# EAGLE design v1 (EAGLE 9.5.2)
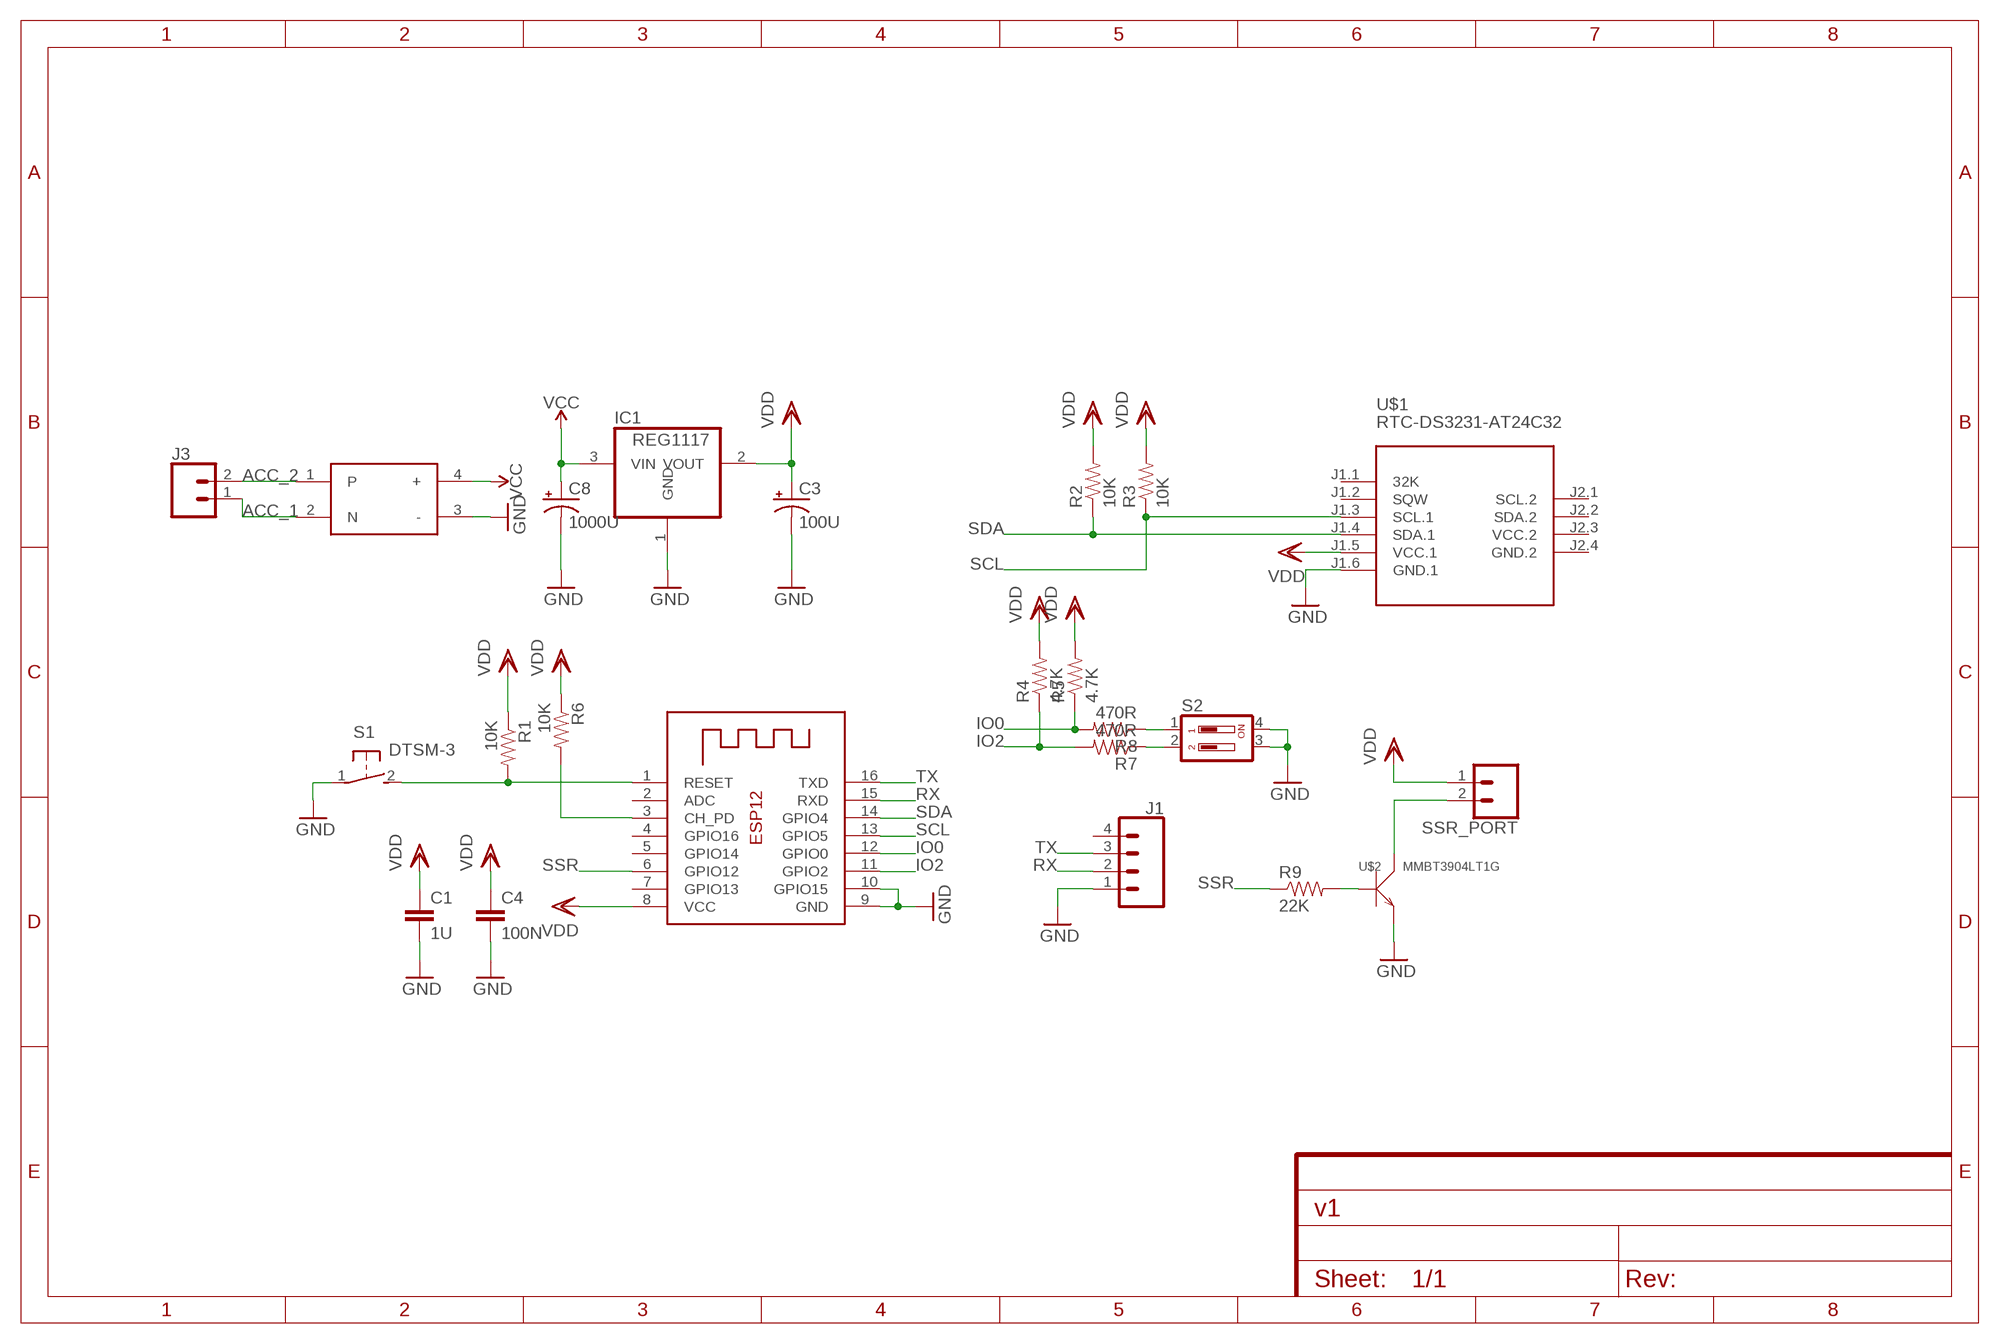
[diagram p0: schematic, sheet 1]

## Parts
C1  1U  CAP1206  [1206]
C3  100U  CAP_POLPTH1  [CPOL-RADIAL-100UF-25V]
C4  100N  CAP1206  [1206]
C8  1000U  1000UF-RADIAL-5MM-25V-20%  [CPOL-RADIAL-5MM-10MM]
IC1  REG1117  [SOT223]
J1  CONN_04  [1X04]
J3  CONN_023.5MM  [SCREWTERMINAL-3.5MM-2]
R1  10K  RESISTOR1206  [1206]
R2  10K  RESISTOR1206  [1206]
R3  10K  RESISTOR1206  [1206]
R4  4.7K  RESISTOR1206  [1206]
R5  4.7K  RESISTOR1206  [1206]
R6  10K  RESISTOR1206  [1206]
R7  470R  RESISTOR1206  [1206]
R8  470R  RESISTOR1206  [1206]
R9  22K  RESISTOR1206  [1206]
S1  DTSM-3  [DTSM-3]
S2  DP02  [DP-02]
SSR_PORT  CONN_023.5MM  [SCREWTERMINAL-3.5MM-2]
U$1  RTC-DS3231-AT24C32  [RTC-DS3231-AT24C32]
U$2  MMBT3904LT1G  SMD-TRANSISTORS-NPN-40V-200MA-MMBT3904LT1G(SOT-23)  [SOT-23]
U$3  AC_DC  [AC_DC]
X1  ESP-12  [ESP-12]

## Nets
ACC_1: J3.1 U$3.2(N)
ACC_2: J3.2 U$3.1(P)
GND: C1.2 C3.2(-) C4.2 C8.- IC1.1(GND) J1.1 S1.1 S2.3 S2.4 U$1.J1.6(GND.1) U$2.2(E) U$3.3(-) X1.9(GND) X1.10(GPIO15)
IO0: R5.1 R8.2 X1.12(GPIO0)
IO2: R4.1 R7.2 X1.11(GPIO2)
N$1: R1.2 S1.2 X1.1(RESET)
N$2: R6.2 X1.3(CH_PD)
N$3: R7.1 S2.2
N$4: R8.1 S2.1
N$6: R9.2 U$2.1(B)
N$8: SSR_PORT.2 U$2.3(C)
RX: J1.2 X1.15(RXD)
SCL: R3.1 U$1.J1.3(SCL.1) X1.13(GPIO5)
SDA: R2.1 U$1.J1.4(SDA.1) X1.14(GPIO4)
SSR: R9.1 X1.6(GPIO12)
TX: J1.3 X1.16(TXD)
VCC: C8.+ IC1.3(VIN) U$3.4(+)
VDD: C1.1 C3.1(+) C4.1 IC1.2(VOUT) R1.1 R2.2 R3.2 R4.2 R5.2 R6.1 SSR_PORT.1 U$1.J1.5(VCC.1) X1.8(VCC)
Unconnected: J1.4 U$1.J1.1(32K) U$1.J1.2(SQW) U$1.J2.1(SCL.2) U$1.J2.2(SDA.2) X1.2(ADC) X1.4(GPIO16) X1.5(GPIO14) X1.7(GPIO13)

## Power pins joined to a net without a drawn wire
GND.2: U$1.J2.4(GND.2)
VCC.2: U$1.J2.3(VCC.2)

## Library data of the parts
C1 C4 = SparkFun-Capacitors:CAP: Generic SMD Capacitor
C3 = SparkFun-Passives:CAP_POL: Capacitor Polarized These are standard SMD and PTH capacitors. Normally 10uF, 47uF, and 100uF in electrolytic and tantalum varieties. Always verify the external diameter of the through hole cap, it varies with capacity, voltage, and manufacturer. The EIA devices should be standard.
C8 = SparkFun-Capacitors:1000UF: 1,000µF/1mF ceramic capacitors A capacitor is a passive two-terminal electrical component used to store electrical energy temporarily in an electric field. CAP-08070; PROD_ID: CAP-09538; VALUE: 1mF
IC1 = Ario-PowerIC:REG1117: 800mA and 1A Low Dropout (LDO) Positive Regulator 1.8V, 2.5V, 2.85V, 3.3V, 5V, and Adj; MPN: REG1117; OC_FARNELL: 1097566; OC_NEWARK: 14P6981
J1 = SparkFun-Connectors:CONN_04: Multi connection point. Often used as Generic Header-pin footprint for 0.1 inch spaced/style header connections On any of the 0.1 inch spaced packages, you can populate with these: Break Away Headers - Straight <https://www.sparkfun.com/products/116> (PRT-00116) Break Away Male Headers - Right Angle <https://www.sparkfun.com/products/553> (PRT-00553) Female Headers <https://www.sparkfun.com/products/115> (PRT-00115) Break Away Headers - Machine Pin <https://www.sparkfun.com/products/117> (PRT-00117) Break Away Female Headers - Swiss Machine Pin <https://www.sparkfun.com/products/743> (PRT-00743) For SCREWTERMINALS and SPRING TERMINALS visit here: Screw Terimnals on SparkFun.com <https://www.sparkfun.com/search/results?term=Screw+Terminals> (5mm/3.5mm/2.54mm spacing) This device is also useful as a general connection point to wire up your design to another part of your project. Our various solder wires solder well into these plated through hole pads. Hook-Up Wire - Assortment (Stranded, 22 AWG) <https://www.sparkfun.com/products/11375> (PRT-11375) Hook-Up Wire - Assortment (Solid Core, 22 AWG) <https://www.sparkfun.com/products/11367> (PRT-11367) View the entire wire category on our website here <https://www.sparkfun.com/categories/141> Special notes: Molex polarized connector foot print use with SKU : PRT-08231 with associated crimp pins and housings. 1MM SMD Version SKU: PRT-10208; PROD_ID: CONN-09696
J3 SSR_PORT = SparkFun-Connectors:CONN_02: Multi connection point. Often used as Generic Header-pin footprint for 0.1 inch spaced/style header connections On any of the 0.1 inch spaced packages, you can populate with these: Break Away Headers - Straight <https://www.sparkfun.com/products/116> (PRT-00116) Break Away Male Headers - Right Angle <https://www.sparkfun.com/products/553> (PRT-00553) Female Headers <https://www.sparkfun.com/products/115> (PRT-00115) Break Away Headers - Machine Pin <https://www.sparkfun.com/products/117> (PRT-00117) Break Away Female Headers - Swiss Machine Pin <https://www.sparkfun.com/products/743> (PRT-00743) For SCREWTERMINALS and SPRING TERMINALS visit here: Screw Terimnals on SparkFun.com <https://www.sparkfun.com/search/results?term=Screw+Terminals> (5mm/3.5mm/2.54mm spacing) This device is also useful as a general connection point to wire up your design to another part of your project. Our various solder wires solder well into these plated through hole pads. Hook-Up Wire - Assortment (Stranded, 22 AWG) <https://www.sparkfun.com/products/11375> (PRT-11375) Hook-Up Wire - Assortment (Solid Core, 22 AWG) <https://www.sparkfun.com/products/11367> (PRT-11367) View the entire wire category on our website here <https://www.sparkfun.com/categories/141> Special notes: Molex polarized connector foot print use with: PRT-08233 with associated crimp pins and housings. 2.54_SCREWTERM for use with PRT-10571. 3.5mm Screw Terminal footprints for PRT-08084 5mm Screw Terminal footprints for use with PRT-08432; PROD_ID: CONN-08399
R1-R9 = SparkFun-Passives:RESISTOR: Resistor Basic schematic elements and footprints for 0603, 1206, and PTH resistors.
S1 = switch-tact:DTSM-3
S2 = switch-dil:DP02: DIL/CODE SWITCH; MPN: MCDP02; OC_FARNELL: 1255233; OC_NEWARK: 26M1095
U$1 = diy-modules:RTC-DS3231-AT24C32: RTC Module with Battery and EEPROM based on DS3231 and AT24C32 chips Tutorial can be found here: https://edwardmallon.wordpress.com/2014/05/21/using-a-cheap-3-ds3231-rtc-at24c32-eeprom-from-ebay/ Click here to find device on ebay.com <http://www.ebay.com/sch/DS3231+AT24C32+module>
U$2 = Seeed-Transistor:SMD-TRANSISTORS-NPN-40V-200MA-MMBT3904LT1G(SOT-23): 305010013; MPN: MMBT3904LT1G
U$3 = Modules:AC_DC
X1 = adafruit:ESP-12

## Board
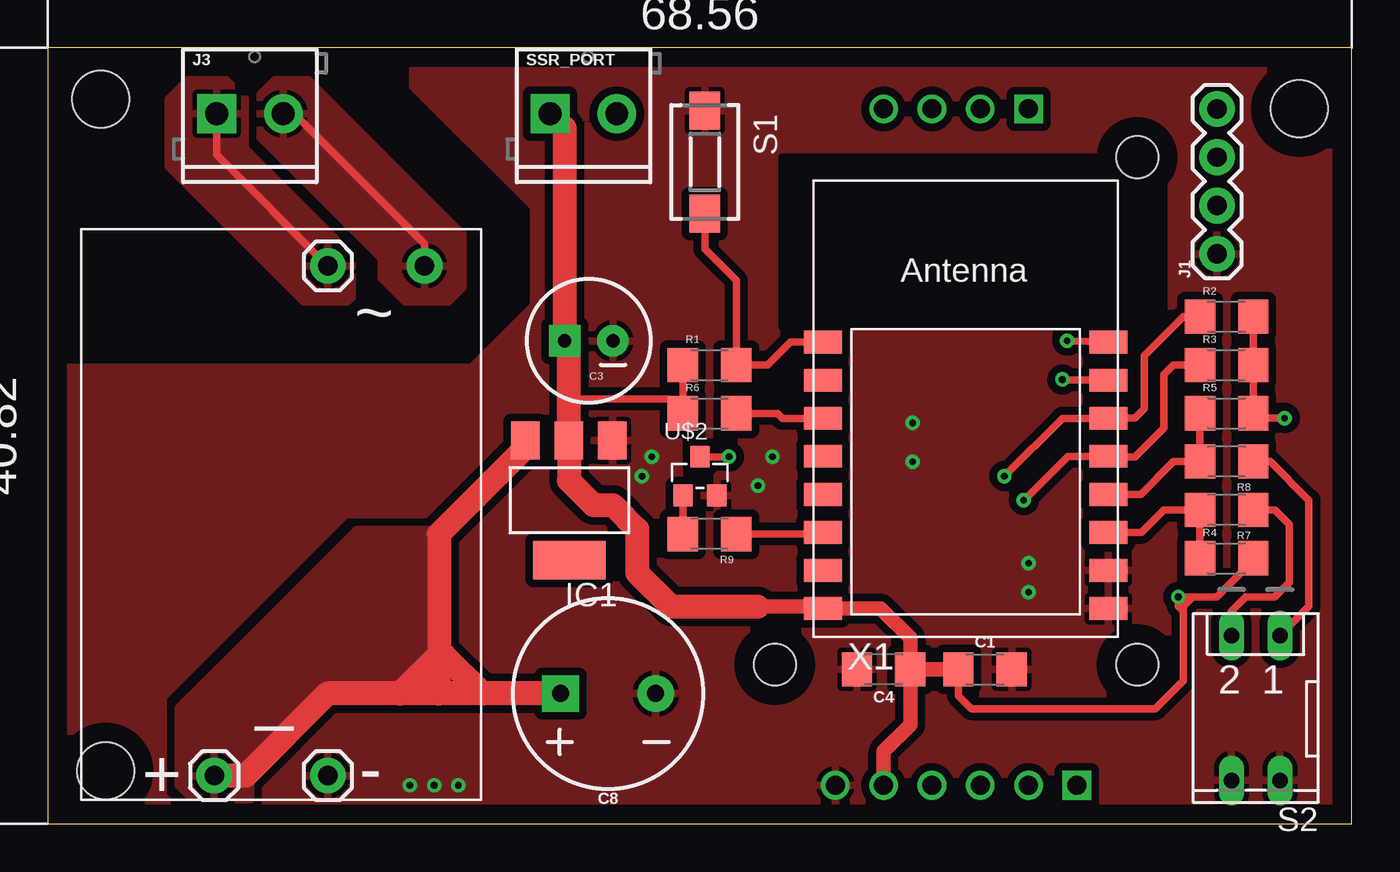
[diagram p1: board, top side]
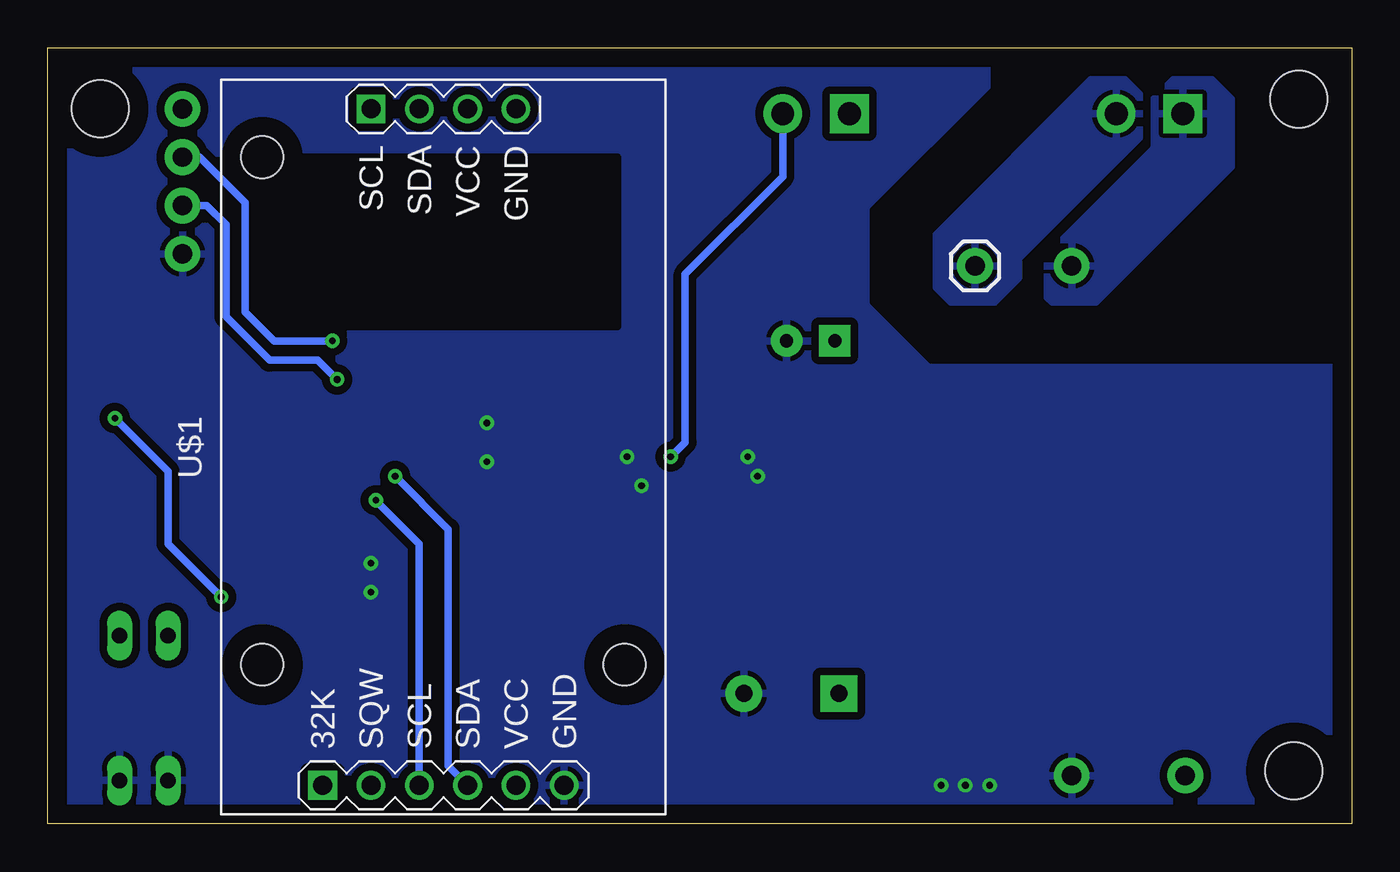
[diagram p2: board, bottom side, seen from below]

Size 68.56 x 40.82 mm. Coordinates in mm from the lower left corner, seen from the top.
Outline: 0,0 68.56,0 68.56,40.82 0,40.82 0,0
Copper layers (1*16): Top 0.035mm / dielectric 1.5mm / Bottom 0.035mm
Design rules "default *": minimum track width 6mil, minimum drill 0.35mm, track to track 16mil, track to pad 16mil, pad to pad 16mil, via to via 16mil, smd to smd 16mil, copper to edge 40mil, drill to drill 6mil, minimum pad ring 10mil, minimum via ring 8mil, stop-mask expansion 4mil, vias tented up to drill 0mil, thermal gap 10mil
Holes 3 mm at 65.79,37.59 3.05,2.79 2.79,38.1

### Footprints (pad centres in the part's own frame; a part is rotated, then mirrored left to right if it is on the bottom)
1206 = smd 1.6 x 1.8: 1 -1.4,0; 2 1.4,0
CPOL-RADIAL-100UF-25V = drill 0.7 pad 1.651 square: 1 1.27,0 | drill 0.7 pad 1.651: 2 -1.27,0
CPOL-RADIAL-5MM-10MM = drill 0.9 pad 1.93 square: + 2.5,0 | drill 0.9 pad 1.93: - -2.5,0
SOT223 = smd 1.499 x 2.007: 1 -2.261,-3.15; 2 0.025,-3.15; 3 2.311,-3.15 | smd 3.81 x 2.007: 4 0,3.15
1X04 = drill 1.016 pad 1.88: 1 0,0; 2 2.54,0; 3 5.08,0; 4 7.62,0
SCREWTERMINAL-3.5MM-2 = drill 1.2 pad 2.032 square: 1 0,0 | drill 1.2 pad 2.032: 2 3.5,0
DTSM-3 = smd 2 x 1.6: 1 -2.7,0; 2 2.7,0
DP-02 = drill 0.813 long: 1 -1.27,-3.81; 2 1.27,-3.81; 3 1.27,3.81; 4 -1.27,3.81
RTC-DS3231-AT24C32 = drill 1 square: J1.1 -17.78,6.35; J2.1 17.78,3.81 | drill 1: J1.2 -17.78,3.81; J1.3 -17.78,1.27; J1.4 -17.78,-1.27; J1.5 -17.78,-3.81; J1.6 -17.78,-6.35; J2.2 17.78,1.27; J2.3 17.78,-1.27; J2.4 17.78,-3.81 | hole 2.2: -11.43,-9.525; -11.43,9.525; 15.24,9.525
SOT-23 = smd 1.016 x 1.143: 1 -0.889,-1.016; 2 0.889,-1.016; 3 0,1.016
AC_DC = drill 1.016 pad 1.88: 1 18.034,28.067; 2 12.954,28.067; 3 12.954,1.27; 4 6.985,1.27
ESP-12 = smd 2 x 1.2: 1 -7.5,4.5; 2 -7.5,2.5; 3 -7.5,0.5; 4 -7.5,-1.5; 5 -7.5,-3.5; 6 -7.5,-5.5; 7 -7.5,-7.5; 8 -7.5,-9.5; 9 7.5,-9.5; 10 7.5,-7.5; 11 7.5,-5.5; 12 7.5,-3.5; 13 7.5,-1.5; 14 7.5,0.5; 15 7.5,2.5; 16 7.5,4.5

### Placement (x,y rotation side)
C1  49.28,8.13 0 top
C3  28.45,25.4 180 top
C4  43.94,8.13 180 top
C8  29.46,6.86 180 top
IC1  27.43,17.02 180 top
J1  61.47,29.97 90 top
J3  8.89,37.34 0 top
R1  34.8,24.13 0 top
R2  61.98,26.67 0 top
R3  61.98,24.13 0 top
R4  61.98,13.97 0 top
R5  61.98,21.59 0 top
R6  34.8,21.59 0 top
R7  61.98,16.51 180 top
R8  61.98,19.05 180 top
R9  34.8,15.24 180 top
S1  34.54,34.8 270 top
S2  63.5,6.1 180 top
SSR_PORT  26.42,37.34 0 top
U$1  47.75,19.81 90 bottom
U$2  34.29,18.29 0 top
U$3  1.78,1.27 0 top
X1  48.26,20.83 0 top

### Tracks (layer width: path | path; a pad name or v marks a point on that pad's centre or on a via)
AC_CUT
  cutout Top: 18.03,41.4 18.03,38.61 24.64,32 24.64,27.94 21.59,24.89 0.51,24.89 -1.27,26.67 -2.03,27.43 -3.81,27.43 -0.76,24.38 22.1,24.38 25.15,27.43 25.15,32.26 18.8,38.61 18.8,41.66 18.54,41.4
AC_CUT_B
  cutout Bottom: 18.29,41.91 18.29,38.35 24.64,32 24.64,27.94 21.59,24.89 0.51,24.89 -2.03,27.43 -3.3,27.43 -3.3,26.92 -0.51,24.13 -0.25,24.38 0,24.38 22.1,24.38 25.15,27.43 25.15,32.26 18.8,38.61 18.8,41.91
ACC_1
  Top 0.406: U$3.2 8.89,35.18 J3.1
  pour Top (rank 2): 16,27.69 16,29.97 10.41,35.56 10.41,38.1 9.4,39.12 7.37,39.12 6.35,38.1 6.35,34.54 13.46,27.43 15.75,27.43
  pour Bottom (rank 2): 9.4,39.12 7.37,39.12 6.35,38.1 6.35,34.54 13.46,27.43 15.75,27.43 16,27.69 16,29.97 10.41,35.56 10.41,38.1
ACC_2
  Top 0.406: J3.2 12.95,37.34 19.81,30.48 U$3.1
  pour Top: 11.18,38.35 11.18,36.07 17.53,29.72 17.53,28.7 18.8,27.43 21.08,27.43 21.84,28.19 21.84,30.99 13.72,39.12 11.94,39.12
  pour Bottom: 11.18,38.35 11.94,39.12 13.72,39.12 21.84,30.99 21.84,28.19 21.08,27.43 18.8,27.43 17.53,28.7 17.53,29.72 11.18,36.07
ANT_CUT
  cutout Top: 38.61,35.05 58.67,35.05 58.67,26.16 38.61,26.16
ANT_CUT_B
  cutout Bottom: 58.67,35.05 58.67,26.16 38.61,26.16 38.61,35.05
GND  (via drill 0.35)
  other vias: 31.75,19.3 31.24,18.29 38.1,19.3 37.34,17.78 19.05,2.03 20.32,2.03 21.59,2.03 51.56,13.72 51.56,12.19 45.47,21.08 45.47,19.05
  pour Top (rank 6): 0.25,40.89 68.58,40.89 68.58,0 0,0 0,40.89
  pour Bottom (rank 6): 0,40.89 68.58,40.89 68.58,0.25 68.83,0 0.25,0 0,-0.25
IO0
  Top 0.406: X1.12 57.46,17.33 59.18,19.05 R8.2 R5.1
IO2
  Top 0.406: X1.11 57.49,15.33 58.67,16.51 R7.2 R4.1
N$1
  Top 0.406: X1.1 39.04,25.33 37.85,24.13 R1.2 36.2,28.57 34.54,30.23 S1.2
N$2
  Top 0.406: X1.3 38.62,21.33 38.35,21.59 R6.2
N$3
  Top 0.406: R7.1 64.52,16.51 65.28,15.75 65.28,12.7 64.52,11.94 62.99,11.94 62.23,11.18 S2.2
N$4
  Top 0.406: R8.1 64.26,19.05 66.29,17.02 66.29,11.43 S2.1
N$6
  Top 0.406: R9.2 U$2.1
N$8  (via drill 0.35)
  Top 0.406: U$2.3 v35.81,19.3
  Bottom 0.406: v35.81,19.3 35.05,20.07 35.05,28.9 29.92,34.04 SSR_PORT.2
RX  (via drill 0.35)
  Top 0.406: X1.15 53.38,23.33 v53.34,23.37
  Bottom 0.406: v53.34,23.37 54.36,24.38 56.9,24.38 59.18,26.67 59.18,31.5 60.2,32.51 J1.2
SCL  (via drill 0.35)
  Top 0.406: v51.31,17.02 53.62,19.33 X1.13 55.78,19.3 57.15,19.3 58.67,20.83 58.67,23.62 59.18,24.13 R3.1
  Bottom 0.406: v51.31,17.02 49.02,14.73 U$1.J1.3
SDA  (via drill 0.35)
  Top 0.406: R2.1 59.69,26.67 57.66,24.64 57.66,21.84 57.15,21.34 X1.14 53.33,21.33 v50.29,18.29
  Bottom 0.406: v50.29,18.29 47.5,15.49 47.5,3.05 U$1.J1.4
SSR
  Top 0.406: X1.6 40.67,15.24 R9.1
TX  (via drill 0.35)
  Top 0.406: X1.16 53.67,25.4 v53.59,25.4
  Bottom 0.406: v53.59,25.4 56.64,25.4 58.17,26.92 58.17,32.66 60.56,35.05 J1.3
VCC
  Top 1.27: C8.+ 22.86,6.86 | 22.86,6.86 20.57,6.86 | 20.57,6.86 18.54,6.86 | 18.54,6.86 14.73,6.86 10.41,2.54 U$3.4 | IC1.3 25.12,19.79 20.57,15.24 20.57,8.89 | 20.57,6.86 20.57,8.89 | 20.57,8.89 18.54,6.86 | 20.57,8.89 20.83,8.89 22.86,6.86
  cutout Top: 7.11,1.02 9.14,1.02 9.65,1.02
  pour Top: 20.57,15.49 20.57,8.64 18.8,6.86 14.73,6.86 10.67,2.79 10.67,1.27 7.62,1.27 6.86,2.03 6.86,6.1 16.26,15.49
VDD  (via drill 0.35)
  Top 0.406: R2.2 R3.2 R5.2 63.5,21.59 63.75,21.34 v65.02,21.34 | R1.1 R6.1 32.64,22.35 27.41,22.35 | R4.2 63.25,13.97 63.25,13.72 61.47,11.94 60.2,11.94 | C1.1 47.88,6.73 48.55,6.06 58.24,6.06 59.69,7.51 59.69,11.18 | 59.69,11.18 59.69,11.43 | 59.69,11.43 60.2,11.94 | v59.44,11.94 60.2,11.94 | v59.44,11.94 59.69,11.68 59.69,11.43 | v59.44,11.94 59.44,11.43 59.69,11.18
  Top 0.762: 37.34,11.43 40.66,11.43 X1.8 43.79,11.33 45.34,9.78 C4.1 | C1.1 C4.1 | U$1.J1.5 43.94,3.81 45.34,5.21 C4.1
  Top 1.27: SSR_PORT.1 27.18,36.58 C3.1 27.41,25.17 27.41,22.35 IC1.2 27.41,18.06 28.7,16.76 29.72,16.76 30.99,15.49 30.99,13.21 32.77,11.43 37.34,11.43
  Bottom 0.406: v65.02,21.34 62.23,18.54 62.23,14.73 v59.44,11.94

### Text on the board
tNames: fuse?